# EAGLE design PassiveRelayBoard1.0 (EAGLE 7.4.0)
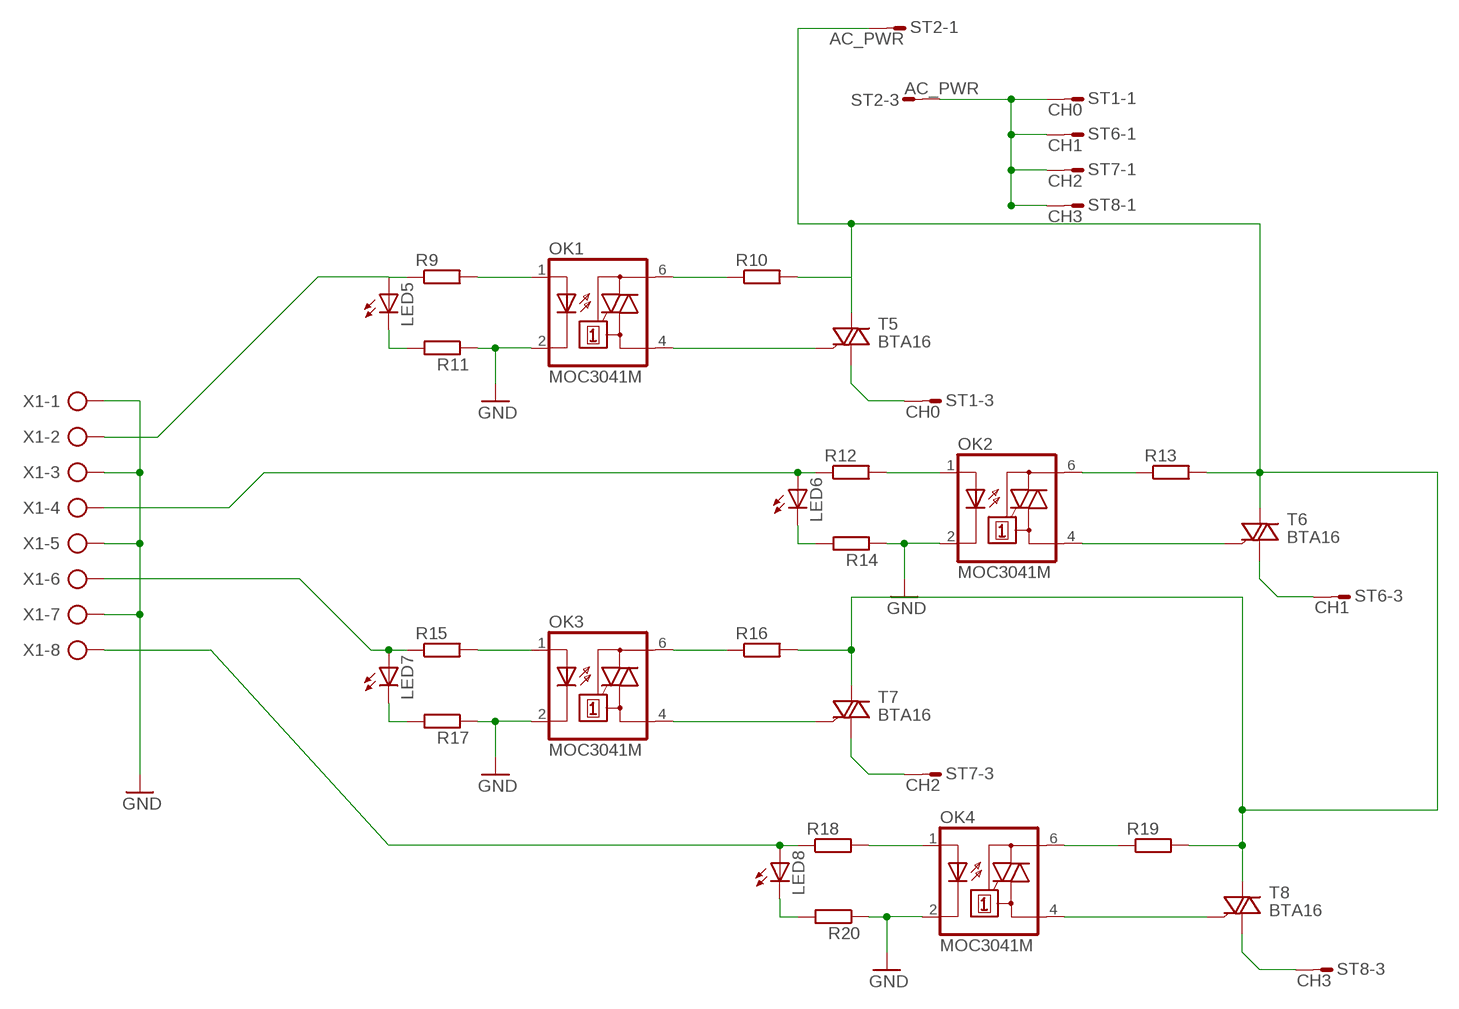
[diagram p0: schematic, sheet 1]

## Parts
LED5  LED3MM  [LED3MM]
LED6  LED3MM  [LED3MM]
LED7  LED3MM  [LED3MM]
LED8  LED3MM  [LED3MM]
OK1  MOC3041M  [DIL06]
OK2  MOC3041M  [DIL06]
OK3  MOC3041M  [DIL06]
OK4  MOC3041M  [DIL06]
R9  R-EU_0207/2V  [0207/2V]
R10  R-EU_0207/7  [0207/7]
R11  R-EU_0204/2V  [0204V]
R12  R-EU_0207/2V  [0207/2V]
R13  R-EU_0207/7  [0207/7]
R14  R-EU_0204/2V  [0204V]
R15  R-EU_0207/2V  [0207/2V]
R16  R-EU_0207/7  [0207/7]
R17  R-EU_0204/2V  [0204V]
R18  R-EU_0207/2V  [0207/2V]
R19  R-EU_0207/7  [0207/7]
R20  R-EU_0204/2V  [0204V]
ST1  CH0  MSF3  [MSF3]
ST2  AC_PWR  MSF3  [MSF3]
ST6  CH1  MSF3  [MSF3]
ST7  CH2  MSF3  [MSF3]
ST8  CH3  MSF3  [MSF3]
T5  BTA16  BT138-V  [TO220BV]
T6  BTA16  BT138-V  [TO220BV]
T7  BTA16  BT138-V  [TO220BV]
T8  BTA16  BT138-V  [TO220BV]
X1  AK300/8  [AK300/8]

## Nets
GND: OK1.2(C) OK2.2(C) OK3.2(C) OK4.2(C) R11.1 R14.1 R17.1 R20.1 X1.1 X1.3 X1.5 X1.7
N$1: R10.2 R13.2 R16.2 R19.2 ST2.1 T5.T2(A2) T6.T2(A2) T7.T2(A2) T8.T2(A2)
N$2: ST1.1 ST2.3 ST6.1 ST7.1 ST8.1
N$24: LED5.A R9.1 X1.2
N$25: OK1.1(A) R9.2
N$26: ST1.3 T5.T1(A1)
N$27: OK1.4(A1) T5.G
N$28: OK1.6(A2) R10.1
N$34: LED5.K(C) R11.2
N$35: LED6.A R12.1 X1.4
N$37: OK2.1(A) R12.2
N$39: OK2.4(A1) T6.G
N$40: OK2.6(A2) R13.1
N$45: ST6.3 T6.T1(A1)
N$46: LED6.K(C) R14.2
N$47: LED7.A R15.1 X1.6
N$50: OK3.1(A) R15.2
N$51: OK3.4(A1) T7.G
N$52: OK3.6(A2) R16.1
N$54: ST7.3 T7.T1(A1)
N$55: LED7.K(C) R17.2
N$56: LED8.A R18.1 X1.8
N$57: OK4.1(A) R18.2
N$58: OK4.4(A1) T8.G
N$59: OK4.6(A2) R19.1
N$61: ST8.3 T8.T1(A1)
N$62: LED8.K(C) R20.2
Unconnected: ST1.2 ST2.2 ST6.2 ST7.2 ST8.2

## Library data of the parts
LED5-LED8 = adafruit:LED: LED OSRAM: - CHIPLED LG R971, LG N971, LY N971, LG Q971, LY Q971, LO R971, LY R971 LH N974, LH R974 LS Q976, LO Q976, LY Q976 LO Q996 - Hyper CHIPLED LW Q18S LB Q993, LB Q99A, LB R99A - SideLED LS A670, LO A670, LY A670, LG A670, LP A670 LB A673, LV A673, LT A673, LW A673 LH A674 LY A675 LS A676, LA A676, LO A676, LY A676, LW A676 LS A679, LY A679, LG A679 - Hyper Micro SIDELED® LS Y876, LA Y876, LO Y876, LY Y876 LT Y87S - SmartLED LW L88C, LW L88S LB L89C, LB L89S, LG L890 LS L89K, LO L89K, LY L89K LS L896, LA L896, LO L896, LY L896 - TOPLED LS T670, LO T670, LY T670, LG T670, LP T670 LSG T670, LSP T670, LSY T670, LOP T670, LYG T670 LG T671, LOG T671, LSG T671 LB T673, LV T673, LT T673, LW T673 LH T674 LS T676, LA T676, LO T676, LY T676, LB T676, LH T676, LSB T676, LW T676 LB T67C, LV T67C, LT T67C, LS T67K, LO T67K, LY T67K, LW E67C LS E67B, LA E67B, LO E67B, LY E67B, LB E67C, LV E67C, LT E67C LW T67C LS T679, LY T679, LG T679 LS T770, LO T770, LY T770, LG T770, LP T770 LB T773, LV T773, LT T773, LW T773 LH T774 LS E675, LA E675, LY E675, LS T675 LS T776, LA T776, LO T776, LY T776, LB T776 LHGB T686 LT T68C, LB T68C - Hyper Mini TOPLED® LB M676 - Mini TOPLED Santana® LG M470 LS M47K, LO M47K, LY M47K Source: http://www.osram.convergy.de/
OK1-OK4 = optocoupler:MOC30*: 6-Pin DIP Zero-Cross Optoisolators Triac Driver Output (250/400 Volt Peak) Source: Data sheet <http://www.fairchildsemi.com/ds/MO/MOC3031M.pdf> The old path of data sheet not more available 2013-05-06.; MF: FAIRCHILD SEMICONDUCTOR; MPN: MOC3041M; OC_FARNELL: 1086677; OC_NEWARK: 78K6090
R9-R20 = rcl:R-EU_: RESISTOR, European symbol
ST1 ST2 ST6-ST8 = con-lumberg:MSF3: MSF CONNECTOR; OC_FARNELL: unknown; OC_NEWARK: unknown
T5-T8 = triac:BT138: TRIAC Source: http://www.semiconductors.philips.com BT138_SERIES_2.pdf
X1 = con-ptr500:AK300/8: CONNECTOR; OC_FARNELL: unknown; OC_NEWARK: unknown

## Board
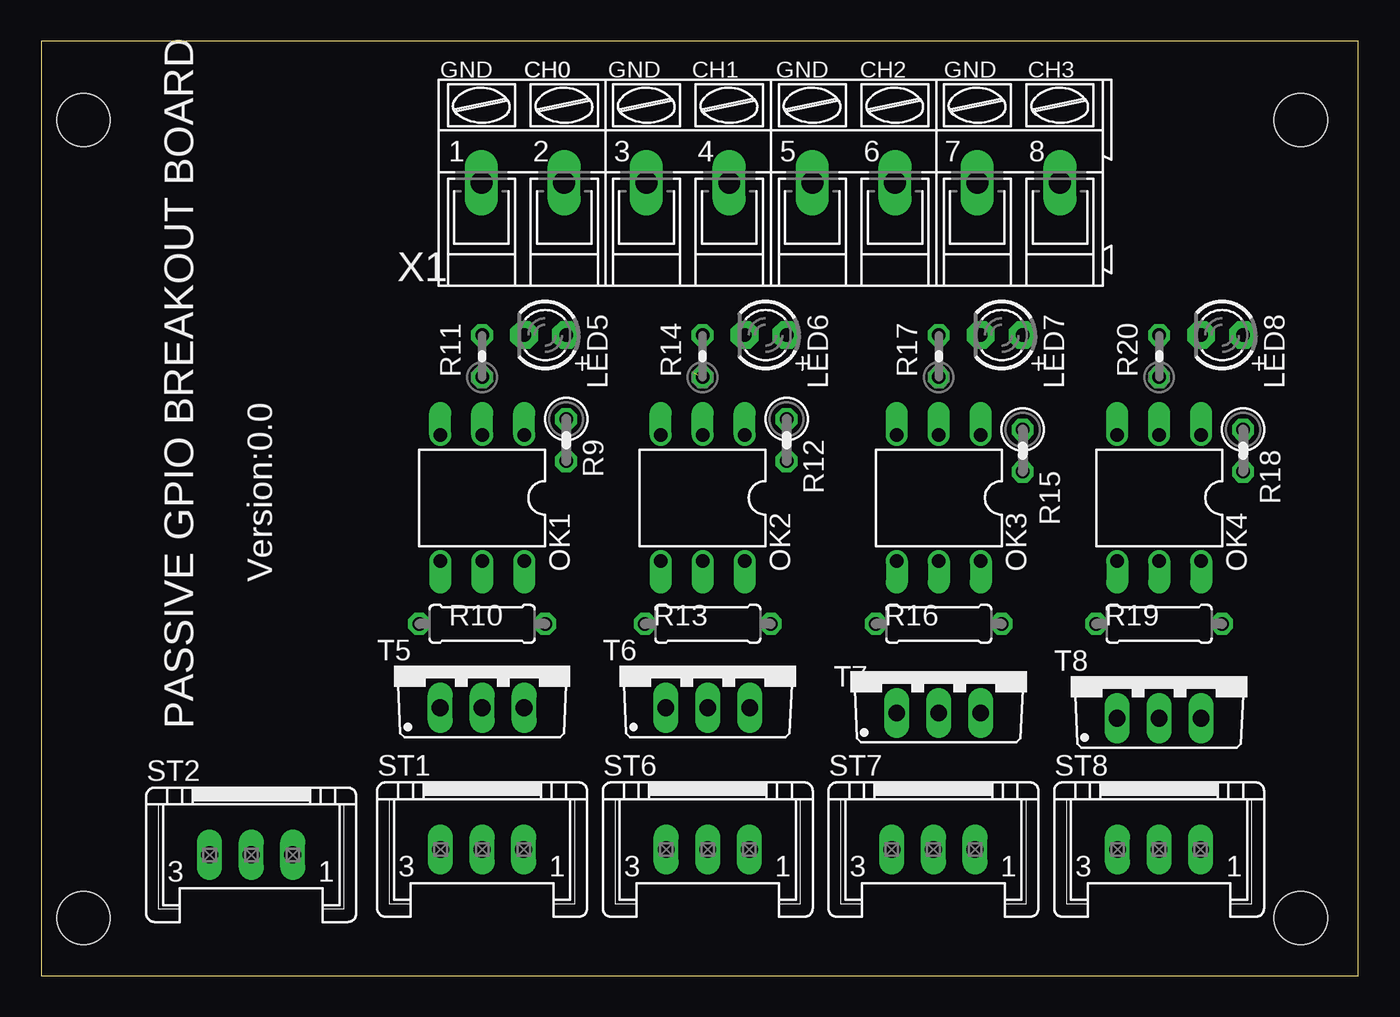
[diagram p1: board, top side]
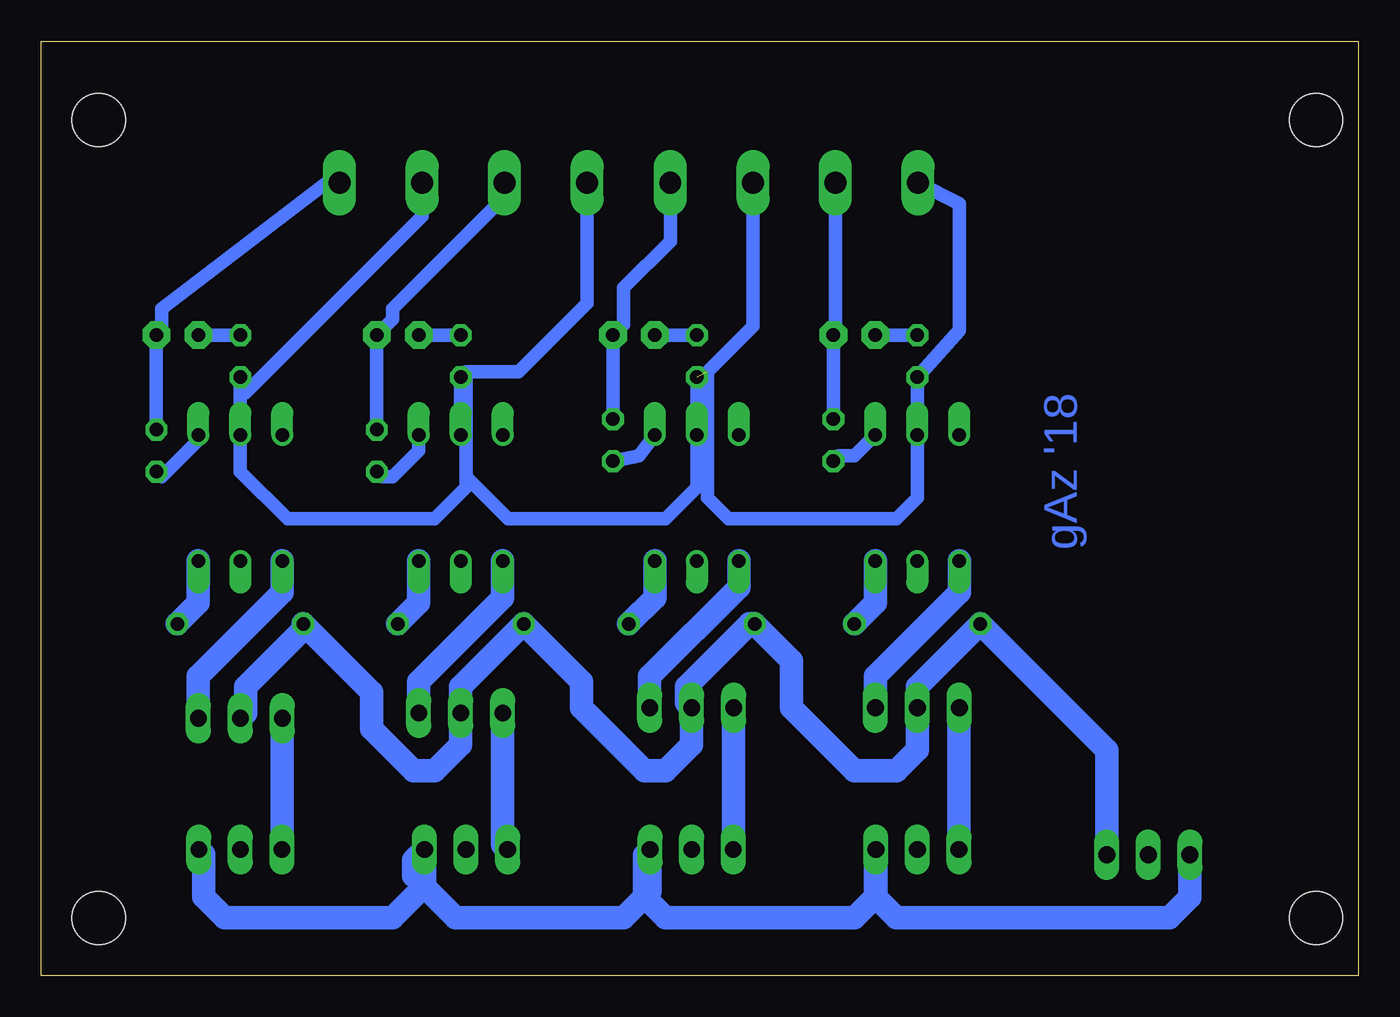
[diagram p2: board, bottom side, seen from below]

Size 79.67 x 56.5 mm. Coordinates in mm from the lower left corner, seen from the top.
Outline: 0,0 79.67,0 79.67,56.5 0,56.5 0,0
Copper layers (1*16): Top 0.035mm / dielectric 1.5mm / Bottom 0.035mm
Design rules "default": minimum track width 10mil, minimum drill 24mil, track to track 8mil, track to pad 8mil, pad to pad 8mil, via to via 8mil, smd to smd 8mil, copper to edge 40mil, drill to drill 8mil, minimum pad ring 10mil, minimum via ring 8mil, stop-mask expansion 4mil, vias tented up to drill 0mil, thermal gap 10mil
Holes 3.2 mm at 2.54,51.75 2.54,3.49 76.2,51.75 76.2,3.49

### Footprints (pad centres in the part's own frame; a part is rotated, then mirrored left to right if it is on the bottom)
LED3MM = drill 0.813 pad 1.676 octagon: A -1.27,0; K 1.27,0
DIL06 = drill 0.813 offset: 1 -2.54,-3.81; 2 0,-3.81; 3 2.54,-3.81; 4 2.54,3.81; 5 0,3.81; 6 -2.54,3.81
0207/2V = drill 0.813 octagon: 1 -1.27,0; 2 1.27,0
0207/7 = drill 0.813 octagon: 1 -3.81,0; 2 3.81,0
0204V = drill 0.813 octagon: 1 -1.27,0; 2 1.27,0
MSF3 = drill 1.016 long: 1 2.515,-2.54; 2 0,-2.54; 3 -2.515,-2.54
TO220BV = drill 1.016 long: G 2.54,-2.54; T1 -2.54,-2.54; T2 0,-2.54
AK300/8 = drill 1.321 long: 1 -17.501,0; 2 -12.497,0; 3 -7.518,0; 4 -2.515,0; 5 2.515,0; 6 7.518,0; 7 12.497,0; 8 17.501,0

### Placement (x,y rotation side)
LED5  30.48,38.73 180 top
LED6  43.81,38.73 180 top
LED7  58.1,38.73 180 top
LED8  71.44,38.73 180 top
OK1  26.67,28.89 180 top
OK2  40.01,28.89 180 top
OK3  54.29,28.89 180 top
OK4  67.63,28.89 180 top
R9  31.75,32.39 270 top
R10  26.67,21.27 180 top
R11  26.67,37.47 90 top
R12  45.09,32.39 270 top
R13  40.32,21.27 180 top
R14  40.01,37.47 90 top
R15  59.37,31.75 270 top
R16  54.29,21.27 180 top
R17  54.29,37.47 90 top
R18  72.71,31.75 270 top
R19  67.63,21.27 180 top
R20  67.63,37.47 90 top
ST1  26.67,10.16 0 top
ST2  12.7,9.84 0 top
ST6  40.32,10.16 0 top
ST7  53.98,10.16 0 top
ST8  67.63,10.16 0 top
T5  26.67,18.73 0 top
T6  40.32,18.73 0 top
T7  54.29,18.41 0 top
T8  67.63,18.1 0 top
X1  44.13,47.94 0 top

### Tracks (layer width: path | path; a pad name or v marks a point on that pad's centre or on a via)
GND  (1 unrouted)
  Bottom 0.813: OK2.2 R14.1 40.01,29.53 41.91,27.62 51.44,27.62 53.98,30.16 | OK3.2 R17.1 53.98,36.51 | X1.1 24.13,46.67 24.13,39.01 R11.1 26.67,33.97 OK1.2 26.67,28.89 27.94,27.62 38.1,27.62 39.37,28.89 39.37,36.51 36.61,39.27 X1.3 | X1.5 46.65,40.67 50.8,36.51 53.98,36.51 | X1.7 56.63,45.92 67.31,35.24 67.31,35.88 R20.1 OK4.2 67.63,30.48 64.77,27.62 55.88,27.62 53.98,29.53 53.98,30.16 | 53.98,36.51 53.98,30.16
N$1
  Bottom 1.422: ST2.1 15.21,13.63 R10.2 26.67,17.46 T5.T2 26.67,13.65 27.94,12.38 30.48,12.38 34.29,16.19 34.29,19.05 R13.2 36.83,21.27 40.64,17.46 40.64,16.51 T6.T2 40.32,13.97 41.91,12.38 43.18,12.38 46.99,16.19 46.99,17.78 R16.2 54.29,17.46 T7.T2 54.29,13.97 55.88,12.38 57.15,12.38 59.69,14.92 59.69,17.14 R19.2 63.82,20.95 67.31,17.46 67.31,15.88 T8.T2
N$2
  Bottom 1.422: ST2.3 10.18,4.74 11.43,3.49 27.94,3.49 29.21,4.76 29.21,7.59 ST1.1 29.19,4.79 30.48,3.49 41.91,3.49 43.18,4.76 43.18,7.28 ST6.1 42.84,5.11 44.45,3.49 54.61,3.49 57.15,6.03 57.15,6.96 ST7.1 56.49,5.42 58.42,3.49 68.58,3.49 69.85,4.76 69.85,7.33 ST8.1
N$24
  Bottom 0.813: X1.2 31.64,38.85 LED5.A R9.1
N$25
  Bottom 0.813: OK1.1 30.48,31.43 31.43,31.43 R9.2
N$26
  Bottom 1.422: ST1.3 24.16,16.17 T5.T1
N$27
  Bottom 1.422: T5.G 29.21,18.1 24.13,23.18 OK1.4
N$28
  Bottom 1.422: OK1.6 29.21,22.54 R10.1
N$34
  Bottom 0.813: LED5.K R11.2
N$35
  Bottom 0.813: X1.4 41.62,44.42 44.45,41.59 44.45,39.37 LED6.A R12.1
N$37
  Bottom 0.813: OK2.1 43.5,31.43 R12.2
N$39
  Bottom 1.422: OK2.4 37.47,23.5 42.86,18.1 T6.G
N$40
  Bottom 1.422: OK2.6 42.55,22.86 R13.1
N$45
  Bottom 1.422: T6.T1 37.78,7.65 ST6.3
N$46
  Bottom 0.813: R14.2 LED6.K
N$47
  Bottom 0.813: X1.6 51.65,47.09 58.42,40.32 58.42,39.69 LED7.A R15.1
N$50
  Bottom 0.813: OK3.1 56.83,31.75 58.42,30.16 59.05,30.16 R15.2
N$51
  Bottom 1.422: OK3.4 51.75,22.86 56.83,17.78 T7.G
N$52
  Bottom 1.422: OK3.6 56.83,22.54 R16.1
N$54
  Bottom 1.422: T7.T1 51.75,7.91 ST7.3
N$55
  Bottom 0.813: R17.2 LED7.K
N$56
  Bottom 0.813: X1.8 61.63,48.54 72.39,40.32 72.39,39.05 LED8.A R18.1
N$57
  Bottom 0.813: OK4.1 70.17,32.39 72.39,30.16 R18.2
N$58
  Bottom 1.422: OK4.4 65.09,23.18 70.17,18.1 T8.G
N$59
  Bottom 1.422: OK4.6 70.17,22.54 R19.1
N$61
  Bottom 1.422: T8.T1 65.09,7.65 ST8.3
N$62
  Bottom 0.813: R20.2 LED8.K

### Text on the board
Bottom: gAz '18
tPlace: GND | CH0 | CH0 | GND | CH1 | GND | CH2 | GND | CH3
tNames: Version:0.0 | PASSIVE GPIO BREAKOUT BOARD